# Altium project STM32_Hobby_Project.PrjPcb
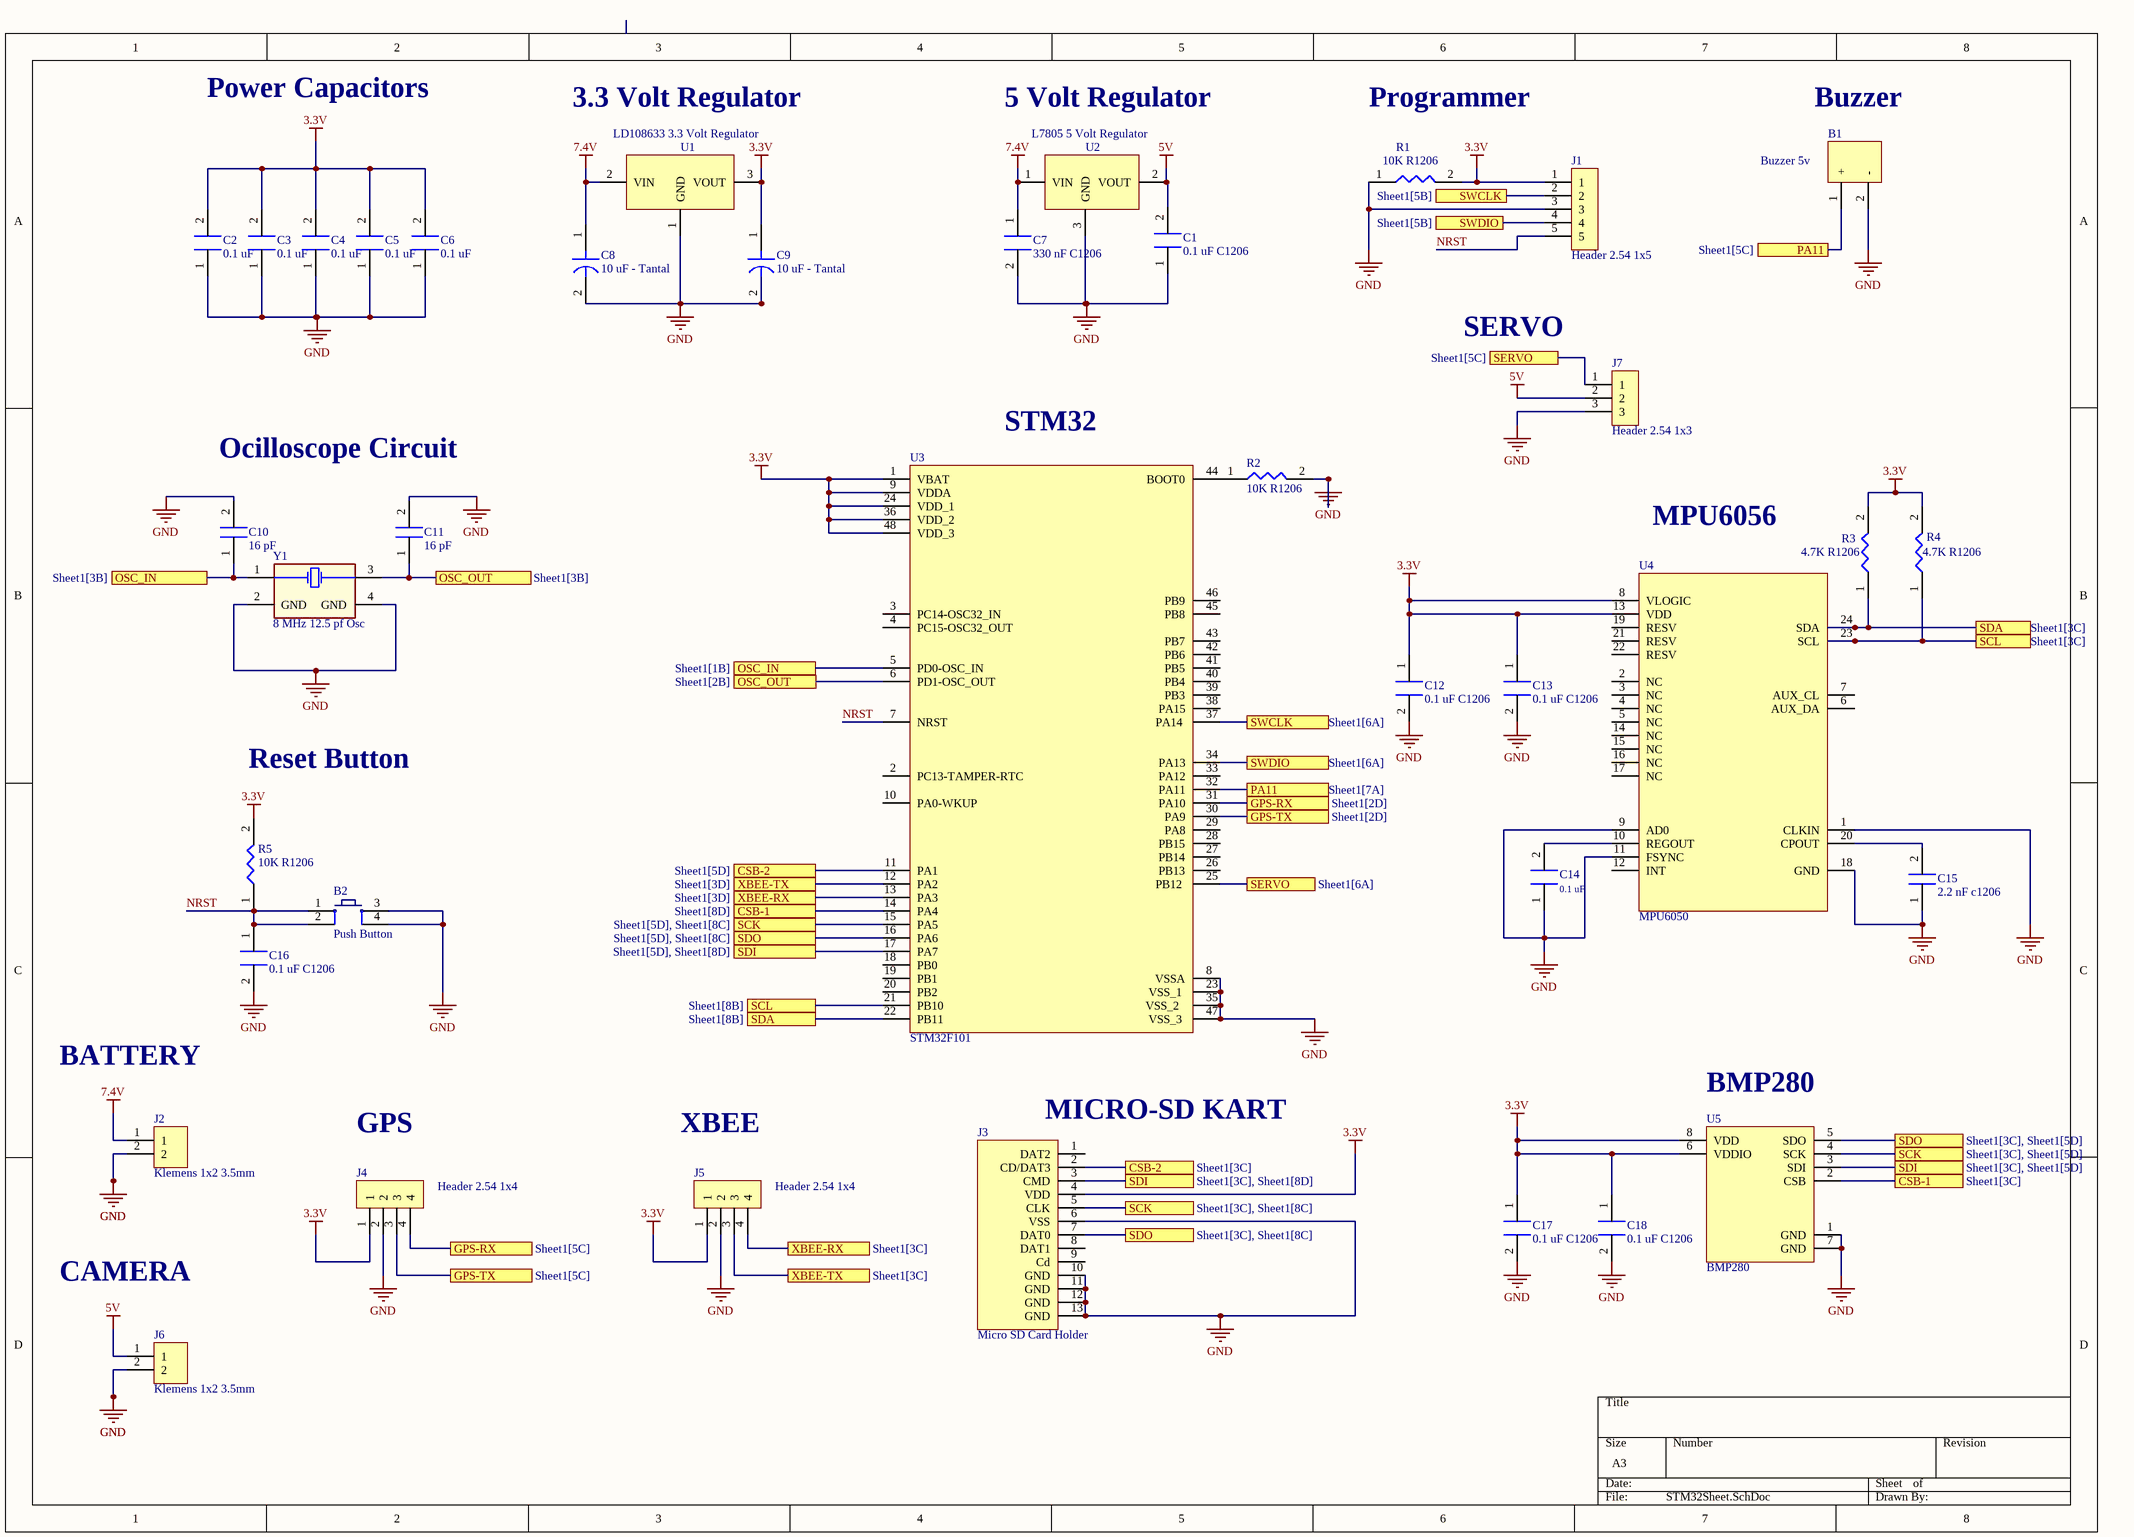
[diagram p0: STM32Sheet.SchDoc]
1 sheet, 38 parts. Net scope: flat (ports and power ports of the same name join across sheets).
Board file: STM32.PcbDoc

## Sheet STM32Sheet.SchDoc
size A3; SheetNumber: 1; SheetTotal: 1

### Parts
B1  Buzzer 5v  [Buzzer 5v]
B2  Push Button  [PUSB BUTTON-SMD]
C1  0.1 uF C1206  [C1206]
C2  0.1 uF  [C1206]
C3  0.1 uF  [C1206]
C4  0.1 uF  [C1206]
C5  0.1 uF  [C1206]
C6  0.1 uF  [C1206]
C7  330 nF C1206  [C1206]
C8  10 uF - Tantal  [C1206- TANTAL]
C9  10 uF - Tantal  [C1206- TANTAL]
C10  16 pF  [C1206]
C11  16 pF  [C1206]
C12  0.1 uF C1206  [C1206]
C13  0.1 uF C1206  [C1206]
C14  0.1 uF  [C1206]
C15  2.2 nF c1206  [C1206]
C16  0.1 uF C1206  [C1206]
C17  0.1 uF C1206  [C1206]
C18  0.1 uF C1206  [C1206]
J1  Header 2.54 1x5  [Header 2.54 1x5]
J2  Klemens 1x2 3.5mm  [Klemens 1x2 - 3.5mm]
J3  Micro SD Card Holder  [Micro SD Card Holder]
J4  Header 2.54 1x4  [Header 2.54 1x4]
J5  Header 2.54 1x4  [Header 2.54 1x4]
J6  Klemens 1x2 3.5mm  [Klemens 1x2 - 3.5mm]
J7  Header 2.54 1x3  [Header 2.54 1x3]
R1  10K R1206  [R1206 Resistor]
R2  10K R1206  [R1206 Resistor]
R3  4.7K R1206  [R1206 Resistor]
R4  4.7K R1206  [R1206 Resistor]
R5  10K R1206  [R1206 Resistor]
U1  LD108633 3.3 Volt Regulator  [DPAK228P972X230-3N]
U2  L7805 5 Volt Regulator  [DPAK228P972X230-3N]
U3  STM32F101  [LQFP48-STM]
U4  MPU6050  [QFN50P400X400X90_HS-25N]
U5  BMP280  [BMP280]
Y1  8 MHz 12.5 pf Osc  [8 MHZ Osc.]

### Ports
CSB-1 (see Sheet1[3C]), CSB-1 (see Sheet1[8D]), CSB-2 (see Sheet1[3C]), CSB-2 (see Sheet1[5D]), GPS-RX (see Sheet1[2D]), GPS-RX (see Sheet1[5C]), GPS-TX (see Sheet1[2D]), GPS-TX (see Sheet1[5C]), OSC_IN (see Sheet1[1B]), OSC_IN (see Sheet1[3B]), OSC_OUT (see Sheet1[2B]), OSC_OUT (see Sheet1[3B]), PA11 (see Sheet1[5C]), PA11 (see Sheet1[7A]), SCK (see Sheet1[3C], Sheet1[5D]), SCK (see Sheet1[3C], Sheet1[8C]), SCK (see Sheet1[5D], Sheet1[8C]), SCL (see Sheet1[3C]), SCL (see Sheet1[8B]), SDA (see Sheet1[3C]), SDA (see Sheet1[8B]), SDI (see Sheet1[3C], Sheet1[5D]), SDI (see Sheet1[3C], Sheet1[8D]), SDI (see Sheet1[5D], Sheet1[8D]), SDO (see Sheet1[3C], Sheet1[5D]), SDO (see Sheet1[3C], Sheet1[8C]), SDO (see Sheet1[5D], Sheet1[8C]), SERVO (see Sheet1[5C]), SERVO (see Sheet1[6A]), SWCLK (see Sheet1[5B]), SWCLK (see Sheet1[6A]), SWDIO (see Sheet1[5B]), SWDIO (see Sheet1[6A]), XBEE-RX (see Sheet1[3C]), XBEE-RX (see Sheet1[3D]), XBEE-TX (see Sheet1[3C]), XBEE-TX (see Sheet1[3D])

### Nets
3.3V: C2.2 C3.2 C4.2 C5.2 C6.2 C9.1 C12.1 C13.1 C17.1 C18.1 J1.1 J3.4(VDD) J4.1 J5.1 R1.2 R3.2 R4.2 R5.2 U1.3(VOUT) U3.1(VBAT) U3.9(VDDA) U3.24(VDD_1) U3.36(VDD_2) U3.48(VDD_3) U4.8(VLOGIC) U4.13(VDD) U5.6(VDDIO) U5.8(VDD)
5V: C1.2 J6.1 J7.2 U2.2(VOUT)
7.4V: C7.1 C8.1 J2.1 U1.2(VIN) U2.1(VIN)
GND: B1.2(-) B2.3 B2.4 C1.1 C2.1 C3.1 C4.1 C5.1 C6.1 C7.2 C8.2 C9.2 C10.2 C11.2 C12.2 C13.2 C14.1 C15.1 C16.2 C17.2 C18.2 J1.3 J2.2 J3.6(VSS) J3.10(GND) J3.11(GND) J3.12(GND) J3.13(GND) J4.2 J5.2 J6.2 J7.3 R1.1 R2.2 U1.1(GND) U2.3(GND) U3.8(VSSA) U3.23(VSS_1) U3.35(VSS_2) U3.47(VSS_3) U4.1(CLKIN) U4.9(AD0) U4.11(FSYNC) U4.18(GND) U5.1(GND) U5.7(GND) Y1.2(GND) Y1.4(GND)
NRST: B2.1 B2.2 C16.1 J1.5 R5.1 U3.7(NRST)
NetB1_1: B1.1(+) U3.32(PA11) ; port PA11
NetC10_1: C10.1 U3.5(PD0-OSC_IN) Y1.1 ; port OSC_IN
NetC11_1: C11.1 U3.6(PD1-OSC_OUT) Y1.3 ; port OSC_OUT
NetC14_2: C14.2 U4.10(REGOUT)
NetC15_2: C15.2 U4.20(CPOUT)
NetJ1_2: J1.2 U3.37(PA14) ; port SWCLK
NetJ1_4: J1.4 U3.34(PA13) ; port SWDIO
NetJ3_2: J3.2(CD/DAT3) U3.11(PA1) ; port CSB-2
NetJ3_3: J3.3(CMD) U3.17(PA7) U5.3(SDI) ; port SDI
NetJ3_5: J3.5(CLK) U3.15(PA5) U5.4(SCK) ; port SCK
NetJ3_7: J3.7(DAT0) U3.16(PA6) U5.5(SDO) ; port SDO
NetJ4_3: J4.3 U3.30(PA9) ; port GPS-TX
NetJ4_4: J4.4 U3.31(PA10) ; port GPS-RX
NetJ5_3: J5.3 U3.12(PA2) ; port XBEE-TX
NetJ5_4: J5.4 U3.13(PA3) ; port XBEE-RX
NetJ7_1: J7.1 U3.25(PB12) ; port SERVO
NetR2_1: R2.1 U3.44(BOOT0)
NetR3_1: R3.1 U3.22(PB11) U4.24(SDA) ; port SDA
NetR4_1: R4.1 U3.21(PB10) U4.23(SCL) ; port SCL
NetU3_14: U3.14(PA4) U5.2(CSB) ; port CSB-1

Not connected (* = marked no-connect by the designer): J3 1(DAT2) 8(DAT1) 9(Cd); U3 2(PC13-TAMPER-RTC) 3(PC14-OSC32_IN) 4(PC15-OSC32_OUT) 10(PA0-WKUP) 18(PB0) 19(PB1) 20(PB2) 26(PB13) 27(PB14) 28(PB15) 29(PA8) 33(PA12) 38(PA15) 39(PB3) 40(PB4) 41(PB5) 42(PB6) 43(PB7) 45(PB8) 46(PB9); U4 2(NC) 3(NC) 4(NC) 5(NC) 6(AUX_DA) 7(AUX_CL) 12(INT) 14(NC) 15(NC) 16(NC) 17(NC) 19(RESV) 21(RESV) 22(RESV)

### Notes on the sheet
- Power Capacitors
- 3.3 Volt Regulator
- 5 Volt Regulator
- Programmer
- Buzzer
- SERVO
- Ocilloscope Circuit
- (near U3) STM32
- MPU6056
- Reset Button
- BATTERY
- GPS
- XBEE
- (near J3) MICRO-SD KART
- (near U5) BMP280
- CAMERA

### Library data of the parts
B2 = Push Button: Smd Push Button; Satın Alma Linki: https://urun.n11.com/diger/mini-pushbutton-switch-smd-P227461537?gclid=Cj0KCQjwkoDmBRCcARIsAG3xzl8Y_-jeD7HocNM6lvuZ_rVp83568XPGtNzlPwXWLph8oCRqo0yh87UaApZYEALw_wcB&gclsrc=aw.ds
C2-C6 C14 = 0.1 uF C1206
U1 = LD108633 DPAK: LD1086 3.3V REGULATOR
U2 = L7805-DPAK: L7805 5V REGULATOR. SMD PAKET
U3 = STM32F101: STM32F101 48 PİNLİ MİKROİŞLEMCİ
U4 = MPU6050: MPU6050 GYRO
U5 = BMP280: BMP280 SENSOR